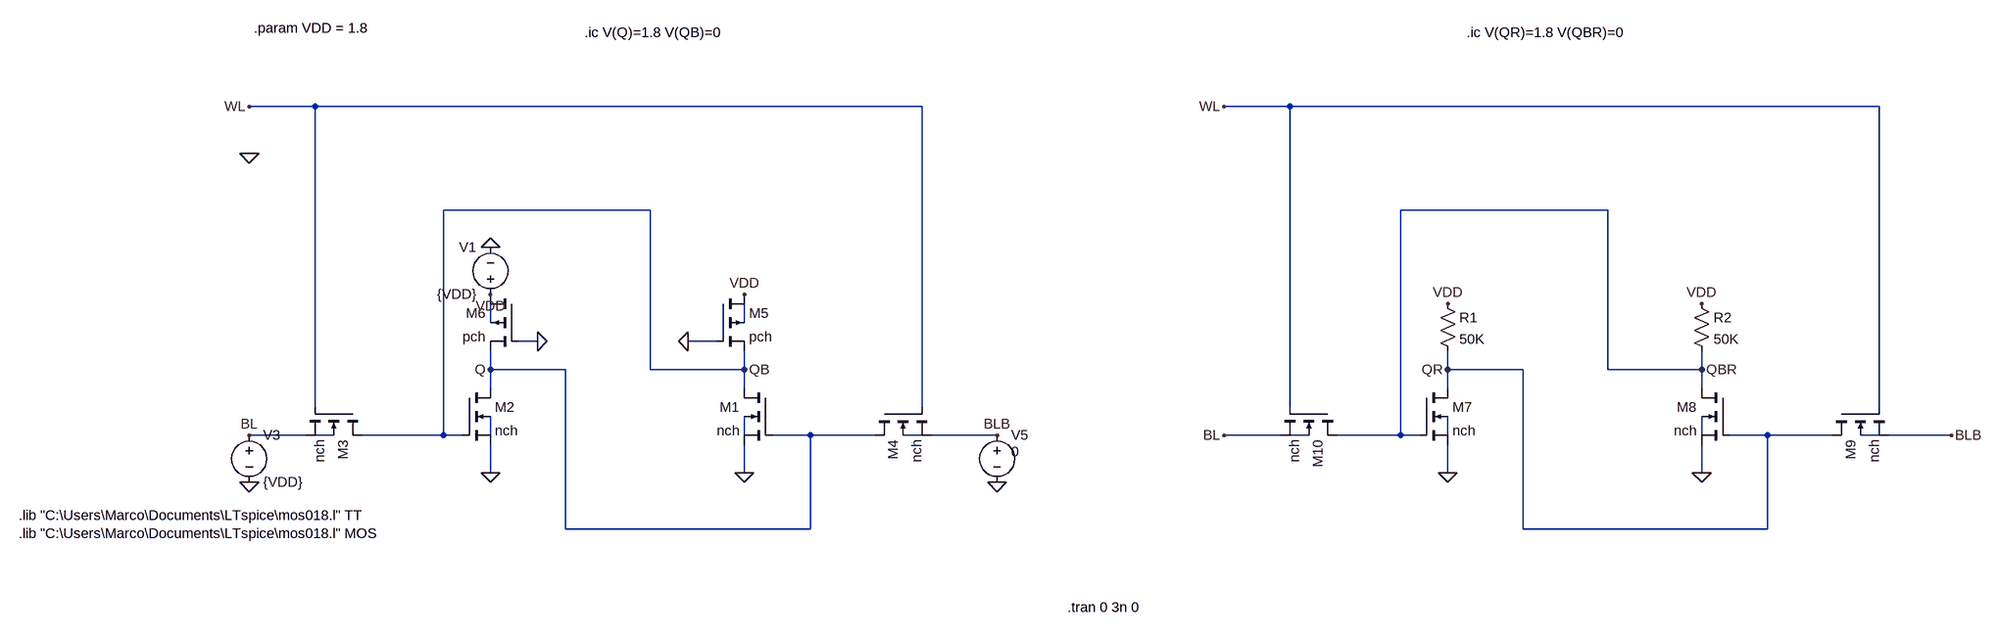
[diagram p0: schematic 4T+2T vs 4T2R SRAM Circuit Passive Power.asc]
4T+2T vs 4T2R SRAM Circuit Passive Power.asc, the LTspice schematic file:
Version 4.1
SHEET 1 2816 828
WIRE -272 -480 -384 -480
WIRE 832 -480 -272 -480
WIRE 1520 -480 1408 -480
WIRE 2624 -480 1520 -480
WIRE 320 -304 -32 -304
WIRE 2112 -304 1760 -304
WIRE 48 -112 48 -144
WIRE 480 -112 480 -144
WIRE 128 -80 96 -80
WIRE 432 -80 384 -80
WIRE 48 -32 48 -64
WIRE 176 -32 48 -32
WIRE 320 -32 320 -304
WIRE 480 -32 480 -64
WIRE 480 -32 320 -32
WIRE 1840 -32 1840 -64
WIRE 1968 -32 1840 -32
WIRE 2112 -32 2112 -304
WIRE 2272 -32 2272 -64
WIRE 2272 -32 2112 -32
WIRE 48 0 48 -32
WIRE 480 0 480 -32
WIRE 1840 0 1840 -32
WIRE 2272 0 2272 -32
WIRE -272 32 -272 -480
WIRE 832 32 832 -480
WIRE 1520 32 1520 -480
WIRE 2624 32 2624 -480
WIRE -288 80 -384 80
WIRE -240 80 -272 80
WIRE -32 80 -32 -304
WIRE -32 80 -192 80
WIRE 0 80 -32 80
WIRE 48 80 48 48
WIRE 480 80 480 48
WIRE 592 80 528 80
WIRE 752 80 592 80
WIRE 832 80 800 80
WIRE 960 80 848 80
WIRE 1504 80 1408 80
WIRE 1552 80 1520 80
WIRE 1760 80 1760 -304
WIRE 1760 80 1600 80
WIRE 1792 80 1760 80
WIRE 1840 80 1840 48
WIRE 2272 80 2272 48
WIRE 2384 80 2320 80
WIRE 2544 80 2384 80
WIRE 2624 80 2592 80
WIRE 2752 80 2640 80
WIRE 48 144 48 96
WIRE 480 144 480 96
WIRE 1840 144 1840 96
WIRE 2272 144 2272 96
WIRE 176 240 176 -32
WIRE 592 240 592 80
WIRE 592 240 176 240
WIRE 1968 240 1968 -32
WIRE 2384 240 2384 80
WIRE 2384 240 1968 240
FLAG 48 144 0
FLAG 480 144 0
FLAG -384 -480 WL
FLAG -384 80 BL
FLAG 960 80 BLB
FLAG 48 -32 Q
FLAG 480 -32 QB
FLAG -384 -400 0
FLAG 48 -240 0
FLAG 48 -160 VDD
FLAG 480 -160 VDD
FLAG 128 -80 0
FLAG 384 -80 0
FLAG 1840 144 0
FLAG 2272 144 0
FLAG 1408 -480 WL
FLAG 1408 80 BL
FLAG 2752 80 BLB
FLAG 1840 -32 QR
FLAG 2272 -32 QBR
FLAG 2272 -144 VDD
FLAG 1840 -144 VDD
FLAG -384 160 0
FLAG 960 160 0
SYMBOL nmos4 0 0 R0
SYMATTR InstName M2
SYMATTR Value nch
SYMATTR Value2 l=180n w=420n
SYMBOL nmos4 528 0 M0
SYMATTR InstName M1
SYMATTR Value nch
SYMATTR Value2 l=180n w=360n
SYMBOL nmos4 752 32 M90
SYMATTR InstName M4
SYMATTR Value nch
SYMATTR Value2 l=180n w=540n
SYMBOL nmos4 -192 32 R90
SYMATTR InstName M3
SYMATTR Value nch
SYMATTR Value2 l=180n w=540n
SYMBOL pmos4 432 -160 R0
SYMATTR InstName M5
SYMATTR Value pch
SYMATTR Value2 l=1.2u w=420n
SYMBOL pmos4 96 -160 M0
SYMATTR InstName M6
SYMATTR Value pch
SYMATTR Value2 l=1.2u w=420n
SYMBOL voltage 48 -144 R180
WINDOW 0 24 96 Left 2
WINDOW 3 24 16 Left 2
WINDOW 123 0 0 Left 0
WINDOW 39 0 0 Left 0
SYMATTR InstName V1
SYMATTR Value {VDD}
SYMBOL nmos4 1792 0 R0
SYMATTR InstName M7
SYMATTR Value nch
SYMATTR Value2 l=180n w=420n
SYMBOL nmos4 2320 0 M0
SYMATTR InstName M8
SYMATTR Value nch
SYMATTR Value2 l=180n w=360n
SYMBOL nmos4 2544 32 M90
SYMATTR InstName M9
SYMATTR Value nch
SYMATTR Value2 l=180n w=540n
SYMBOL nmos4 1600 32 R90
SYMATTR InstName M10
SYMATTR Value nch
SYMATTR Value2 l=180n w=540n
SYMBOL res 1824 -160 R0
SYMATTR InstName R1
SYMATTR Value 50K
SYMBOL res 2256 -160 R0
SYMATTR InstName R2
SYMATTR Value 50K
SYMBOL voltage -384 64 R0
WINDOW 123 0 0 Left 0
WINDOW 39 0 0 Left 0
SYMATTR InstName V3
SYMATTR Value {VDD}
SYMBOL voltage 960 64 R0
WINDOW 3 24 44 Left 2
WINDOW 123 0 0 Left 0
WINDOW 39 0 0 Left 0
SYMATTR Value 0
SYMATTR InstName V5
TEXT -776 216 Left 2 !.lib "C:\\Users\\Marco\\Documents\\LTspice\\mos018.l" TT\n.lib "C:\\Users\\Marco\\Documents\\LTspice\\mos018.l" MOS
TEXT -376 -664 Left 2 !.param VDD = 1.8
TEXT 208 -656 Left 2 !.ic V(Q)=1.8 V(QB)=0
TEXT 1872 -656 Left 2 !.ic V(QR)=1.8 V(QBR)=0
TEXT 1080 448 Left 2 !.tran 0 3n 0

The netlist it stands for:
* 4T+2T vs 4T2R SRAM Circuit Passive Power.asc
M2 Q QB 0 N004 nch l=180n w=420n
M1 QB Q 0 N005 nch l=180n w=360n
M4 Q WL BLB N006 nch l=180n w=540n
M3 QB WL BL N003 nch l=180n w=540n
M5 VDD 0 QB N002 pch l=1.2u w=420n
M6 VDD 0 Q N001 pch l=1.2u w=420n
V1 VDD 0 {VDD}
M7 QR QBR 0 N008 nch l=180n w=420n
M8 QBR QR 0 N009 nch l=180n w=360n
M9 QR WL BLB N010 nch l=180n w=540n
M10 QBR WL BL N007 nch l=180n w=540n
R1 VDD QR 50K
R2 VDD QBR 50K
V3 BL 0 {VDD}
V5 BLB 0 0
.model NMOS NMOS
.model PMOS PMOS
.lib standard.mos
.lib "C:\Users\Marco\Documents\LTspice\mos018.l" TT
.lib "C:\Users\Marco\Documents\LTspice\mos018.l" MOS
.param VDD = 1.8
.ic V(Q)=1.8 V(QB)=0
.ic V(QR)=1.8 V(QBR)=0
.tran 0 3n 0
.backanno
.end